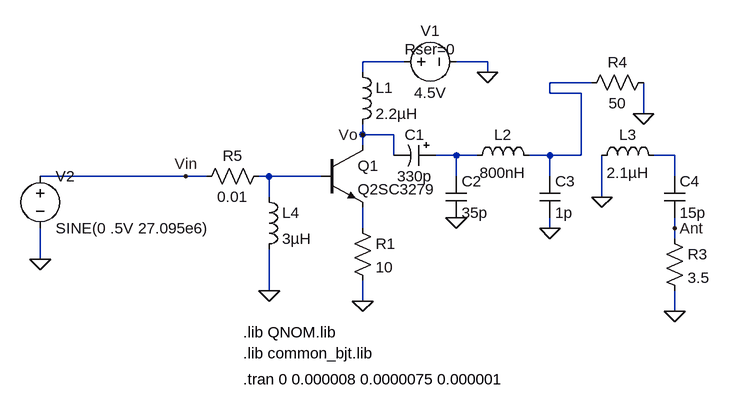
[diagram p0: schematic 27Mhz-PA-improvement.asc]
27Mhz-PA-improvement.asc, the LTspice schematic file:
Version 4
SHEET 1 880 680
WIRE 256 -32 192 -32
WIRE 384 -32 336 -32
WIRE 192 -16 192 -32
WIRE 384 -16 384 -32
WIRE 544 0 480 0
WIRE 480 16 480 0
WIRE 528 16 480 16
WIRE 624 48 624 0
WIRE 192 80 192 64
WIRE 240 80 192 80
WIRE 192 96 192 80
WIRE 240 112 240 80
WIRE 336 112 304 112
WIRE 368 112 336 112
WIRE 480 112 448 112
WIRE 528 112 528 16
WIRE 528 112 480 112
WIRE 672 112 640 112
WIRE -80 144 -304 144
WIRE -48 144 -80 144
WIRE 48 144 32 144
WIRE 128 144 48 144
WIRE 336 144 336 112
WIRE 480 144 480 112
WIRE 672 144 672 112
WIRE 48 176 48 144
WIRE 560 176 560 112
WIRE 192 224 192 192
WIRE 480 224 480 208
WIRE 672 224 672 208
WIRE 672 240 672 224
WIRE -304 272 -304 224
WIRE 48 320 48 256
WIRE 192 336 192 304
WIRE 672 352 672 320
FLAG 192 336 0
FLAG 48 320 0
FLAG 336 208 0
FLAG 480 224 0
FLAG 384 -16 0
FLAG 672 352 0
FLAG -304 272 0
FLAG 672 224 Ant
FLAG 624 48 0
FLAG -80 144 Vin
FLAG 192 80 Vo
FLAG 560 176 0
SYMBOL res 176 208 R0
SYMATTR InstName R1
SYMATTR Value 10
SYMATTR SpiceLine tol=1% pwr=1
SYMBOL ind 176 -32 R0
SYMATTR InstName L1
SYMATTR Value 2.2µH
SYMATTR SpiceLine Ipk=1 Rser=0.0478 Rpar=1e4 Cpar=0
SYMBOL ind 352 128 R270
WINDOW 0 32 56 VTop 2
WINDOW 3 5 56 VBottom 2
SYMATTR InstName L2
SYMATTR Value 800nH
SYMATTR SpiceLine Ipk=1 Rser=0.03 Rpar=1e4 Cpar=0.3p
SYMBOL polcap 304 96 R90
WINDOW 0 0 32 VBottom 2
WINDOW 3 32 32 VTop 2
SYMATTR InstName C1
SYMATTR Value 330p
SYMATTR Description Capacitor
SYMATTR Type cap
SYMATTR SpiceLine V=50 Irms=0.5 Rser=0.03 Lser=0 Rpar=1e4 Cpar=0.1e-12
SYMBOL cap 320 144 R0
SYMATTR InstName C2
SYMATTR Value 35p
SYMATTR SpiceLine V=100 Irms=1 Rser=0.01 Lser=0 Rpar=1e5 Cpar=0
SYMBOL cap 464 144 R0
SYMATTR InstName C3
SYMATTR Value 1p
SYMATTR SpiceLine V=100 Irms=0.7 Rser=0.03 Lser=0 Rpar=1e5 Cpar=0
SYMBOL npn 128 96 R0
SYMATTR InstName Q1
SYMATTR Value Q2SC3279
SYMBOL ind 544 128 R270
WINDOW 0 32 56 VTop 2
WINDOW 3 5 56 VBottom 2
SYMATTR InstName L3
SYMATTR Value 2.1µH
SYMATTR SpiceLine Ipk=1 Rser=0.03 Rpar=1e4 Cpar=0.3p
SYMBOL cap 656 144 R0
SYMATTR InstName C4
SYMATTR Value 15p
SYMATTR SpiceLine V=100 Irms=0.7 Rser=0.03 Lser=10nH Rpar=1e5 Cpar=0
SYMBOL res 656 224 R0
SYMATTR InstName R3
SYMATTR Value 3.5
SYMATTR SpiceLine tol=1% pwr=1
SYMBOL voltage 240 -32 R270
WINDOW 0 32 56 VTop 2
WINDOW 3 -32 56 VBottom 2
WINDOW 123 0 0 Left 2
WINDOW 39 4 56 VTop 2
SYMATTR InstName V1
SYMATTR Value 4.5V
SYMATTR SpiceLine Rser=0
SYMBOL voltage -304 128 R0
WINDOW 123 0 0 Left 2
WINDOW 39 0 0 Left 2
SYMATTR InstName V2
SYMATTR Value SINE(0 .5V 27.095e6)
SYMBOL res 528 16 R270
WINDOW 0 32 56 VTop 2
WINDOW 3 0 56 VBottom 2
SYMATTR InstName R4
SYMATTR Value 50
SYMATTR SpiceLine tol=1% pwr=1
SYMBOL res -64 160 R270
WINDOW 0 32 56 VTop 2
WINDOW 3 0 56 VBottom 2
SYMATTR InstName R5
SYMATTR Value 0.01
SYMATTR SpiceLine tol=1% pwr=1
SYMBOL ind 32 160 R0
SYMATTR InstName L4
SYMATTR Value 3µH
SYMATTR SpiceLine Ipk=1 Rser=0.0478 Rpar=1e4 Cpar=0
TEXT 8 416 Left 2 !.lib common_bjt.lib
TEXT 8 456 Left 2 !.tran 0 0.000008 0.0000075 0.000001
TEXT 8 384 Left 2 !.lib QNOM.lib

The netlist it stands for:
* 27Mhz-PA-improvement.asc
R1 N006 0 10 tol=1% pwr=1
L1 N001 Vo 2.2µH Ipk=1 Rser=0.0478 Rpar=1e4 Cpar=0
L2 N003 N002 800nH Ipk=1 Rser=0.03 Rpar=1e4 Cpar=0.3p
C1 N003 Vo 330p V=50 Irms=0.5 Rser=0.03 Lser=0 Rpar=1e4 Cpar=0.1e-12
C2 N003 0 35p V=100 Irms=1 Rser=0.01 Lser=0 Rpar=1e5 Cpar=0
C3 N002 0 1p V=100 Irms=0.7 Rser=0.03 Lser=0 Rpar=1e5 Cpar=0
Q1 Vo N005 N006 0 Q2SC3279
L3 0 N004 2.1µH Ipk=1 Rser=0.03 Rpar=1e4 Cpar=0.3p
C4 N004 Ant 15p V=100 Irms=0.7 Rser=0.03 Lser=10nH Rpar=1e5 Cpar=0
R3 Ant 0 3.5 tol=1% pwr=1
V1 N001 0 4.5V Rser=0
V2 Vin 0 SINE(0 .5V 27.095e6)
R4 N002 0 50 tol=1% pwr=1
R5 Vin N005 0.01 tol=1% pwr=1
L4 N005 0 3µH Ipk=1 Rser=0.0478 Rpar=1e4 Cpar=0
.model NPN NPN
.model PNP PNP
.lib standard.bjt
.lib common_bjt.lib
.tran 0 0.000008 0.0000075 0.000001
.lib QNOM.lib
.backanno
.end